# EAGLE design c64saver (EAGLE 6.0)
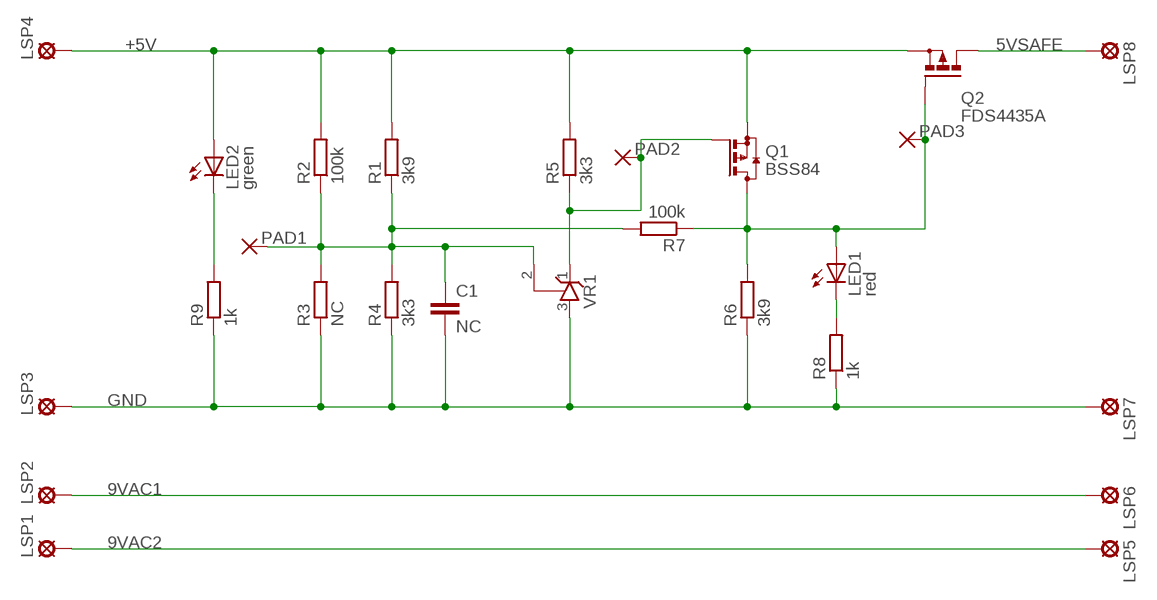
[diagram p0: schematic, sheet 1]

## Parts
C1  NC  C-EUC0603  [C0603]
LED1  red  LEDCHIPLED_1206  [CHIPLED_1206]
LED2  green  LEDCHIPLED_1206  [CHIPLED_1206]
LSP1  SE14  [SE14]
LSP2  SE14  [SE14]
LSP3  SE14  [SE14]
LSP4  SE14  [SE14]
LSP5  SE14  [SE14]
LSP6  SE14  [SE14]
LSP7  SE14  [SE14]
LSP8  SE14  [SE14]
PAD1  SMD2  [SMD1,27-2,54]
PAD2  SMD2  [SMD1,27-2,54]
PAD3  SMD2  [SMD1,27-2,54]
Q1  BSS84  [SOT23]
Q2  FDS4435A  P-MOSFET-SO8  [SO-08]
R1  3k9  R-EU_R0603  [R0603]
R2  100k  R-EU_R0603  [R0603]
R3  NC  R-EU_R0603  [R0603]
R4  3k3  R-EU_R0603  [R0603]
R5  3k3  R-EU_R0603  [R0603]
R6  3k9  R-EU_R0603  [R0603]
R7  100k  R-EU_R0603  [R0603]
R8  1k  R-EU_R0603  [R0603]
R9  1k  R-EU_R0603  [R0603]
VR1  TL431CLPSOT23  [SOT23]

## Nets
5VSAFE: LSP8.MP Q2.5(D) Q2.6(D) Q2.7(D) Q2.8(D)
9VAC1: LSP2.MP LSP6.MP
9VAC2: LSP1.MP LSP5.MP
+5V: LED2.A LSP4.MP Q1.2(S) Q2.1(S) Q2.2(S) Q2.3(S) R1.2 R2.2 R5.2
GND: C1.2 LSP3.MP LSP7.MP R3.1 R4.1 R6.1 R8.1 R9.1 VR1.3(A)
N$2: C1.1 PAD1.1(P) R1.1 R2.1 R3.2 R4.2 R7.2 VR1.2(R)
N$3: LED1.C R8.2
N$4: LED2.C R9.2
N$5: PAD2.1(P) Q1.1(G) R5.1 VR1.1(C)
N$7: LED1.A PAD3.1(P) Q1.3(D) Q2.4(G) R6.2 R7.1

## Library data of the parts
C1 = rcl:C-EU: CAPACITOR, European symbol
LED1 LED2 = led:LED: LED OSRAM: - CHIPLED LG R971, LG N971, LY N971, LG Q971, LY Q971, LO R971, LY R971 LH N974, LH R974 LS Q976, LO Q976, LY Q976 LO Q996 - Hyper CHIPLED LW Q18S LB Q993, LB Q99A, LB R99A - SideLED LS A670, LO A670, LY A670, LG A670, LP A670 LB A673, LV A673, LT A673, LW A673 LH A674 LY A675 LS A676, LA A676, LO A676, LY A676, LW A676 LS A679, LY A679, LG A679 - Hyper Micro SIDELED® LS Y876, LA Y876, LO Y876, LY Y876 LT Y87S - SmartLED LW L88C, LW L88S LB L89C, LB L89S, LG L890 LS L89K, LO L89K, LY L89K LS L896, LA L896, LO L896, LY L896 - TOPLED LS T670, LO T670, LY T670, LG T670, LP T670 LSG T670, LSP T670, LSY T670, LOP T670, LYG T670 LG T671, LOG T671, LSG T671 LB T673, LV T673, LT T673, LW T673 LH T674 LS T676, LA T676, LO T676, LY T676, LB T676, LH T676, LSB T676, LW T676 LB T67C, LV T67C, LT T67C, LS T67K, LO T67K, LY T67K, LW E67C LS E67B, LA E67B, LO E67B, LY E67B, LB E67C, LV E67C, LT E67C LW T67C LS T679, LY T679, LG T679 LS T770, LO T770, LY T770, LG T770, LP T770 LB T773, LV T773, LT T773, LW T773 LH T774 LS E675, LA E675, LY E675, LS T675 LS T776, LA T776, LO T776, LY T776, LB T776 LHGB T686 LT T68C, LB T68C - Hyper Mini TOPLED® LB M676 - Mini TOPLED Santana® LG M470 LS M47K, LO M47K, LY M47K Source: http://www.osram.convergy.de LUXEON: - LUMILED® LXK2-PW12-R00, LXK2-PW12-S00, LXK2-PW14-U00, LXK2-PW14-V00 LXK2-PM12-R00, LXK2-PM12-S00, LXK2-PM14-U00 LXK2-PE12-Q00, LXK2-PE12-R00, LXK2-PE12-S00, LXK2-PE14-T00, LXK2-PE14-U00 LXK2-PB12-K00, LXK2-PB12-L00, LXK2-PB12-M00, LXK2-PB14-N00, LXK2-PB14-P00, LXK2-PB14-Q00 LXK2-PR12-L00, LXK2-PR12-M00, LXK2-PR14-Q00, LXK2-PR14-R00 LXK2-PD12-Q00, LXK2-PD12-R00, LXK2-PD12-S00 LXK2-PH12-R00, LXK2-PH12-S00 LXK2-PL12-P00, LXK2-PL12-Q00, LXK2-PL12-R00 Source: www.luxeon.com KINGBRIGHT: KA-3528ASYC Source: www.kingbright.com
LSP1-LSP8 = solpad:SE14: SOLDER PAD E1553, drill 1,4mm, distributor Buerklin, 07F820
PAD1-PAD3 = wirepad:SMD2: SMD PAD
Q1 = transistor-small-signal:BSS84: P-CHANNEL MOS FET
Q2 = transistor-power:P-MOSFET-SO8: P-Channel MOSFET Example: FDS4435A; P-Channel Logic Level PowerTrench® MOSFET FDS4465; P-Channel 1.8V Specified PowerTrench® MOSFET Source: www.fairchildsemi.com
R1-R9 = rcl:R-EU_: RESISTOR, European symbol
VR1 = v-reg:TL431CLP: VOLTAGE REGULATOR

## Board
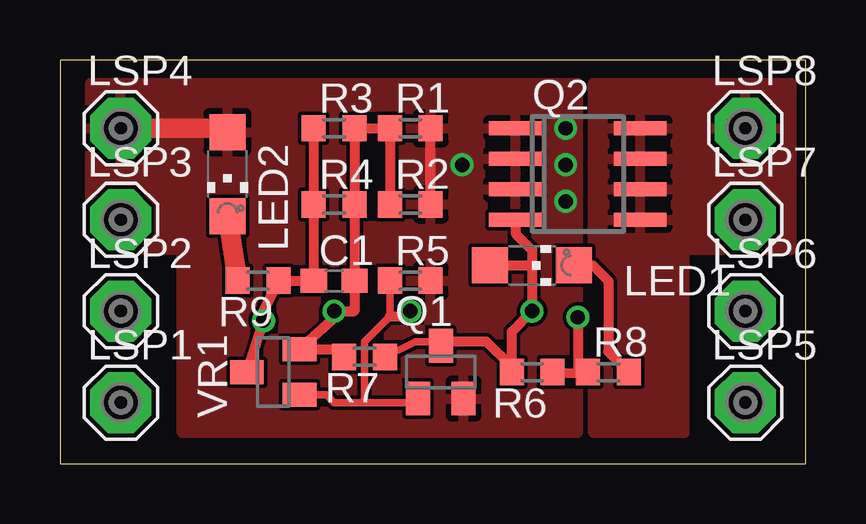
[diagram p1: board, top side]
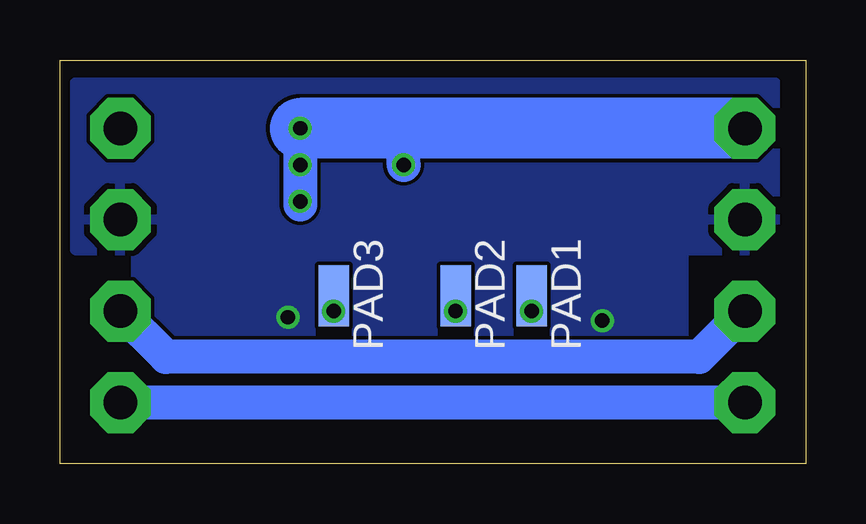
[diagram p2: board, bottom side, seen from below]

Size 31.09 x 16.82 mm. Coordinates in mm from the lower left corner, seen from the top.
Outline: 0,0 31.09,0 31.09,16.82 0,16.82 0,0
Copper layers (1*16): Top 0.0356mm / dielectric 1.5011mm / Bottom 0.0356mm
Design rules: minimum track width 6mil, minimum drill 13mil, track to track 6mil, track to pad 6mil, pad to pad 6mil, via to via 6mil, smd to smd 6mil, copper to edge 15mil, drill to drill 6mil, minimum pad ring 7mil, minimum via ring 7mil, stop-mask expansion 3mil, vias tented up to drill 0mil, thermal gap 10mil

### Footprints (pad centres in the part's own frame; a part is rotated, then mirrored left to right if it is on the bottom)
C0603 = smd 1.1 x 1: 1 -0.85,0; 2 0.85,0
CHIPLED_1206 = smd 1.5 x 1.5: A 0,-1.75; C 0,1.75
SE14 = drill 1.397 pad 2.54 octagon: MP 0,0
SMD1,27-2,54 = smd 1.27 x 2.54: 1 0,0
SOT23 = smd 1 x 1.4: 1 -0.95,-1.1; 2 0.95,-1.1; 3 0,1.1
SO-08 = smd 0.6 x 2.2: 1 -1.905,-2.6; 2 -0.635,-2.6; 3 0.635,-2.6; 4 1.905,-2.6; 5 1.905,2.6; 6 0.635,2.6; 7 -0.635,2.6; 8 -1.905,2.6
R0603 = smd 1 x 1.1: 1 -0.85,0; 2 0.85,0

### Placement (x,y rotation side)
C1  11.43,7.62 180 top
LED1  19.68,8.26 270 top
LED2  6.99,12.06 180 top
LSP1  2.54,2.54 0 top
LSP2  2.54,6.35 0 top
LSP3  2.54,10.16 0 top
LSP4  2.54,13.97 0 top
LSP5  28.57,2.54 0 top
LSP6  28.57,6.35 0 top
LSP7  28.57,10.16 0 top
LSP8  28.57,13.97 0 top
PAD1  11.43,6.99 180 bottom
PAD2  14.61,6.99 180 bottom
PAD3  19.68,6.99 180 bottom
Q1  15.88,3.81 0 top
Q2  21.59,12.06 270 top
R1  14.61,13.97 0 top
R2  14.61,10.79 0 top
R3  11.43,13.97 0 top
R4  11.43,10.79 0 top
R5  14.61,7.62 0 top
R6  19.68,3.81 180 top
R7  12.7,4.45 180 top
R8  22.86,3.81 0 top
R9  8.26,7.62 180 top
VR1  8.89,3.81 90 top

### Tracks (layer width: path | path; a pad name or v marks a point on that pad's centre or on a via)
5VSAFE
  pour Top: 22.23,15.88 30.48,15.88 30.48,8.89 26.04,8.89 26.04,1.27 22.23,1.27
9VAC1
  Bottom 1.422: LSP2.MP 4.45,4.45 26.67,4.45 LSP6.MP
9VAC2
  Bottom 1.422: LSP1.MP LSP5.MP
+5V  (via drill 0.6)
  Top 0.406: R2.2 R1.2
  Top 0.813: LSP4.MP 6.35,13.97 LED2.A
  Bottom 1.422: v21.08,13.97 21.08,10.79 | v16.76,12.45 16.76,13.72
  Bottom 2.54: LSP4.MP v21.08,13.97
  other vias: 21.08,12.45 21.08,10.92
  pour Top: 21.59,15.88 21.59,1.27 5.08,1.27 5.08,8.89 1.27,8.89 1.27,15.88
GND  (via drill 0.6)
  Top 0.406: R3.1 R4.1 C1.2 R9.1 8.47,6.35 | 8.47,6.35 8.47,5.88 VR1.3 | R6.1 21.68,3.77 | 21.68,3.77 R8.1 | 8.47,6.35 v8.49,5.96 | v21.59,6.1 21.59,3.81 21.63,3.77 21.68,3.77
  pour Bottom: 1.27,15.88 30.48,15.88 30.48,8.89 27.94,8.89 27.94,1.27 5.08,1.27 5.08,8.89 1.27,8.89
N$2  (via drill 0.6)
  Top 0.406: 11.75,6.35 VR1.2 11.85,4.76 R7.2 | v11.43,6.35 11.75,6.35 | 11.75,6.35 12.28,6.35 C1.1 R4.2 R3.2 R1.1 R2.1
  Bottom 0.406: v11.43,6.35 PAD1.1
N$3
  Top 0.406: LED1.C 22.23,8.26 22.86,7.62 22.86,4.66 R8.2
N$4
  Top 0.813: LED2.C R9.2
N$5  (via drill 0.6)
  Top 0.305: R5.1 13.76,6.13 12.7,5.08 12.7,2.54 | 12.7,2.54 14.76,2.54 Q1.1 | 12.7,2.54 11.43,2.54 11.11,2.86 VR1.1
  Top 0.406: 13.76,6.13 14.39,6.13 v14.61,6.35
  Bottom 0.406: PAD2.1 v14.61,6.35
N$7  (via drill 0.6)
  Top 0.305: R7.1 14.82,5.08 15.88,5.08
  Top 0.406: Q2.4 18.99,9.59 19.68,8.89 19.68,8.26 | 19.68,8.26 v19.68,6.35 18.84,5.5 R6.2 18.84,4.03 17.78,5.08 15.88,5.08 Q1.3 16.05,5.08 | LED1.A 19.68,8.26
  Bottom 0.406: PAD3.1 v19.68,6.35

### Text on the board
bStop: C64 Saver V1.0 | by bwack | 2015